# EAGLE design dab_mainboard (EAGLE 7.2.0)
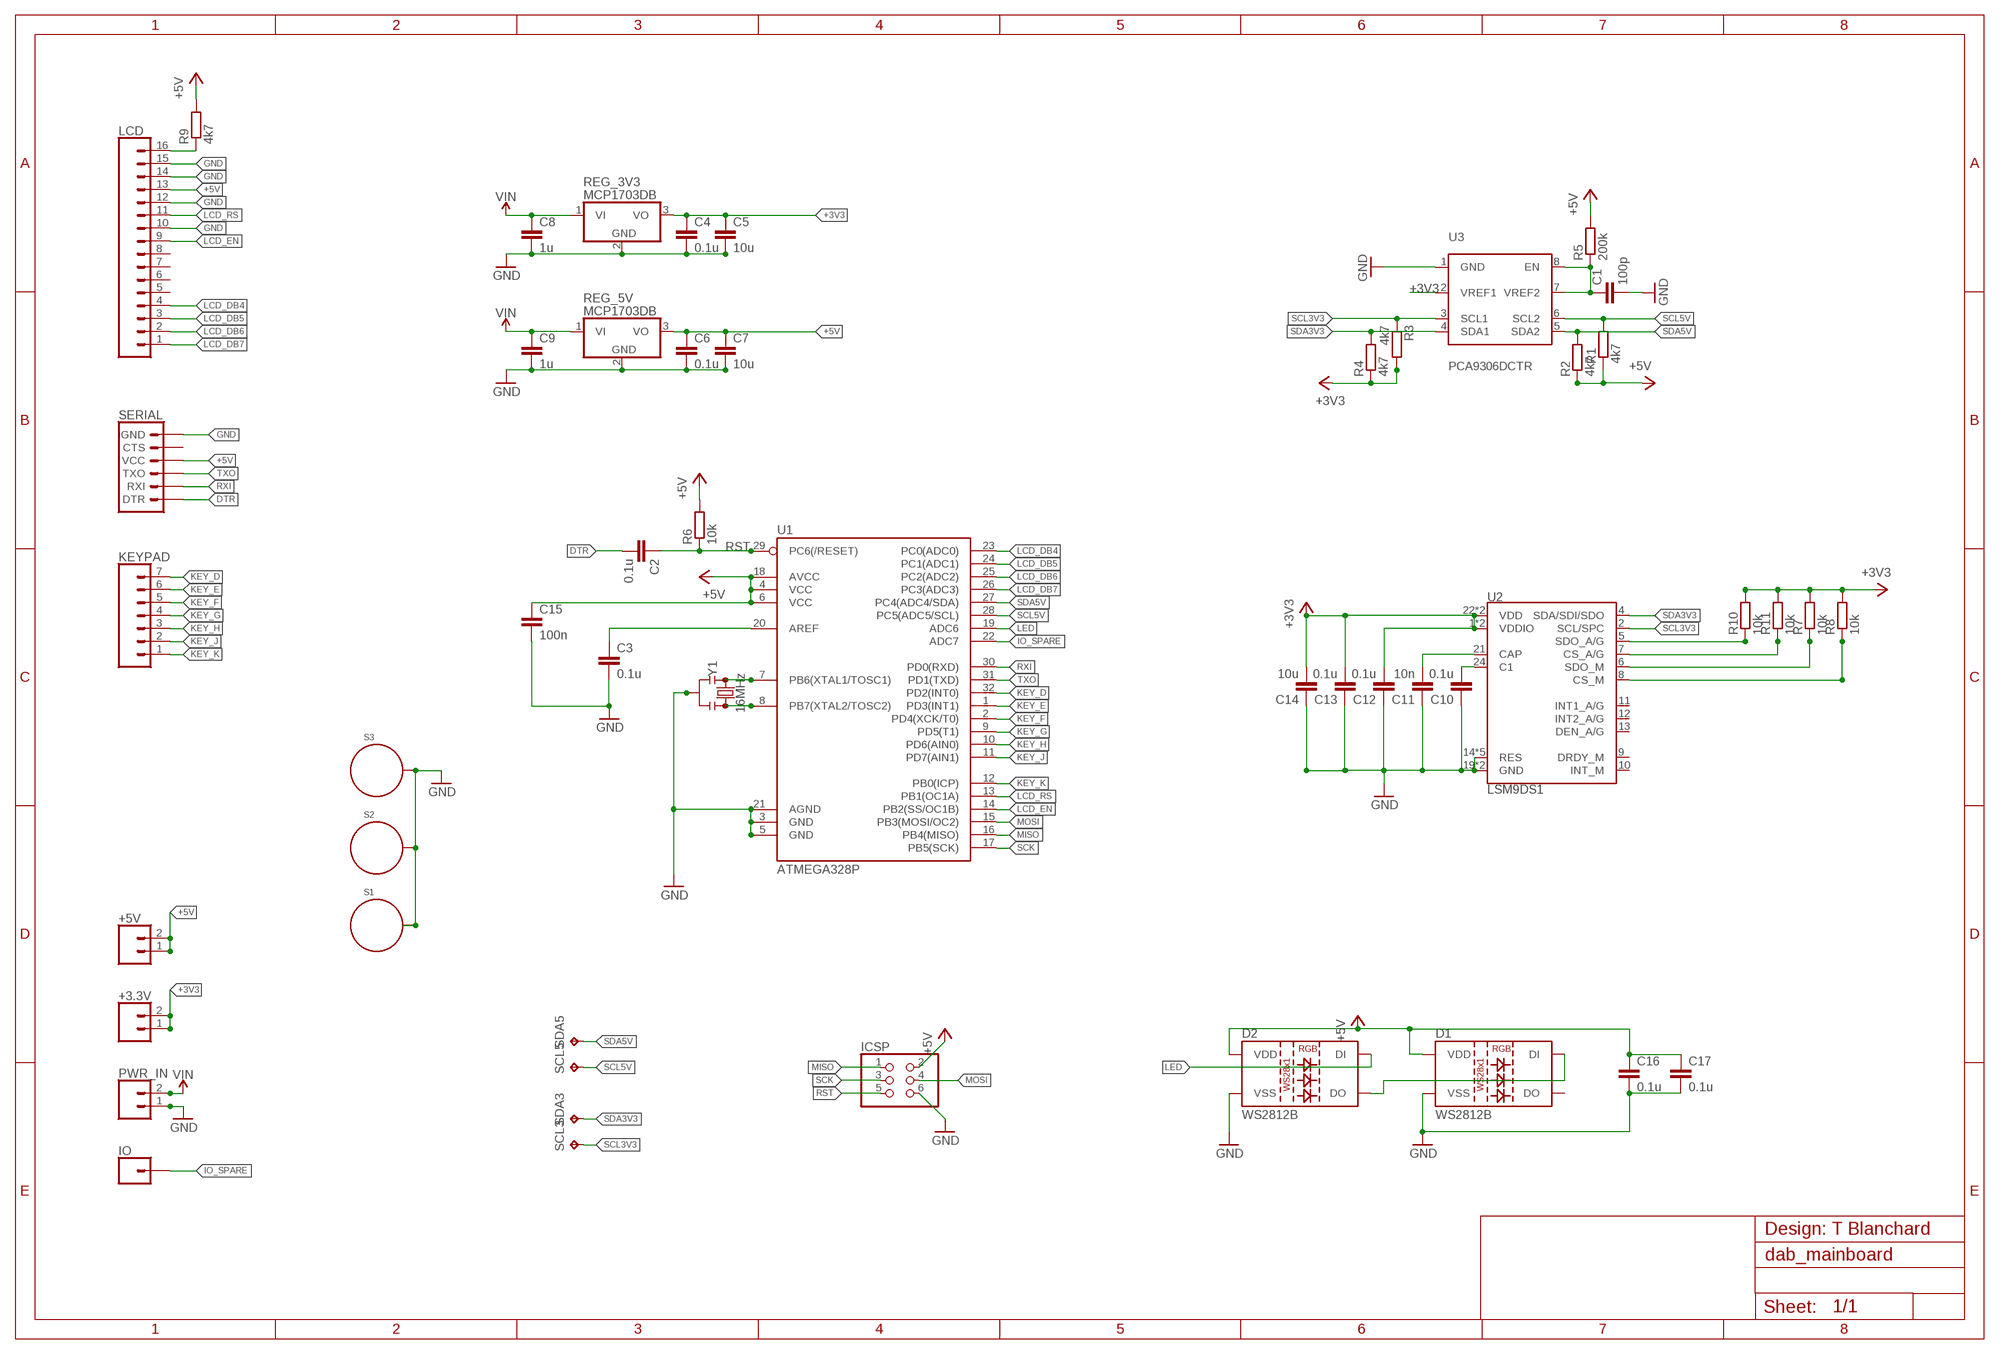
[diagram p0: schematic, sheet 1]

## Parts
+3.3V  CONN_02  [1X02]
+5V  CONN_02  [1X02]
C1  100p  C-EUC0603  [C0603]
C2  0.1u  C-EUC0603  [C0603]
C3  0.1u  C-EUC0603  [C0603]
C4  0.1u  C-EUC0603  [C0603]
C5  10u  C-EUC0805  [C0805]
C6  0.1u  C-EUC0603  [C0603]
C7  10u  C-EUC0805  [C0805]
C8  1u  C-EUC0603  [C0603]
C9  1u  C-EUC0603  [C0603]
C10  0.1u  C-EUC0603  [C0603]
C11  10n  C-EUC0603  [C0603]
C12  0.1u  C-EUC0603  [C0603]
C13  0.1u  C-EUC0603  [C0603]
C14  10u  C-EUC0603  [C0603]
C15  100n  C-EUC0603  [C0603]
C16  0.1u  C-EUC0603  [C0603]
C17  0.1u  C-EUC0603  [C0603]
D1  WS2812B  [WS2812B]
D2  WS2812B  [WS2812B]
ICSP  PINHD-2X3  [2X03]
IO  CONN_01  [1X01]
KEYPAD  CONN_07  [1X07]
LCD  CONN_16  [1X16]
PWR_IN  CONN_02  [1X02]
R1  4k7  R-EU_R0603  [R0603]
R2  4k7  R-EU_R0603  [R0603]
R3  4k7  R-EU_R0603  [R0603]
R4  4k7  R-EU_R0603  [R0603]
R5  200k  R-EU_R0603  [R0603]
R6  10k  R-EU_R0603  [R0603]
R7  10k  R-EU_R0603  [R0603]
R8  10k  R-EU_R0603  [R0603]
R9  4k7  R-EU_R0603  [R0603]
R10  10k  R-EU_R0603  [R0603]
R11  10k  R-EU_R0603  [R0603]
REG_3V3  MCP1703DB  [SOT223]
REG_5V  MCP1703DB  [SOT223]
S1  STANDOFF_ELECTRICAL  [STANDOFF-ELECTRICAL]
S2  STANDOFF_ELECTRICAL  [STANDOFF-ELECTRICAL]
S3  STANDOFF_ELECTRICAL  [STANDOFF-ELECTRICAL]
SCL3  TPTP08R  [TP08R]
SCL5  TPTP08R  [TP08R]
SDA3  TPTP08R  [TP08R]
SDA5  TPTP08R  [TP08R]
SERIAL  6_PIN_SERIAL_TARGETSILK  [6_PIN_SERIAL_TARGET_SIDE_W_SILK]
U1  ATMEGA328P  ATMEGA328P_TQFP  [TQFP32-08]
U2  LSM9DS1  [LGA-24-3.5X3]
U3  PCA9306DCTR  [SM8]
Y1  16MHz  RESONATOR-16MHZSMD_3.2X1.3  [RESONATOR-SMD-3.2X1.3]

## Nets
+3V3: +3.3V.1 +3.3V.2 C4.1 C5.1 C12.2 C13.2 C14.2 R3.2 R4.1 R7.2 R8.2 R10.2 R11.2 REG_3V3.3(VO) U2.1(VDDIO) U2.3(VDDIO) U2.22(VDD) U2.23(VDD) U3.2(VREF1)
+5V: +5V.1 +5V.2 C6.1 C7.1 C15.1 C16.1 C17.1 D1.1(VDD) D2.1(VDD) ICSP.2 LCD.13 R1.1 R2.1 R5.2 R6.2 R9.2 REG_5V.3(VO) SERIAL.P$4(VCC) U1.4(VCC) U1.6(VCC) U1.18(AVCC)
CS_M: R8.1 U2.8(CS_M)
DTR: C2.2 SERIAL.P$1(DTR)
GND: C1.2 C3.2 C4.2 C5.2 C6.2 C7.2 C8.2 C9.2 C10.1 C11.1 C12.1 C13.1 C14.1 C15.2 C16.2 C17.2 D1.3(VSS) D2.3(VSS) ICSP.6 LCD.10 LCD.12 LCD.14 LCD.15 PWR_IN.1 REG_3V3.2(GND) REG_5V.2(GND) S1.P1 S2.P1 S3.P1 SERIAL.P$6(GND) U1.3(GND) U1.5(GND) U1.21(AGND) U2.14(RES) U2.15(RES) U2.16(RES) U2.17(RES) U2.18(RES) U2.19(GND) U2.20(GND) U3.1(GND) Y1.2
IO_SPARE: IO.1 U1.22(ADC7)
KEY_D: KEYPAD.7 U1.32(PD2(INT0))
KEY_E: KEYPAD.6 U1.1(PD3(INT1))
KEY_F: KEYPAD.5 U1.2(PD4(XCK/T0))
KEY_G: KEYPAD.4 U1.9(PD5(T1))
KEY_H: KEYPAD.3 U1.10(PD6(AIN0))
KEY_J: KEYPAD.2 U1.11(PD7(AIN1))
KEY_K: KEYPAD.1 U1.12(PB0(ICP))
LCD_DB4: LCD.4 U1.23(PC0(ADC0))
LCD_DB5: LCD.3 U1.24(PC1(ADC1))
LCD_DB6: LCD.2 U1.25(PC2(ADC2))
LCD_DB7: LCD.1 U1.26(PC3(ADC3))
LCD_EN: LCD.9 U1.14(PB2(SS/OC1B))
LCD_RS: LCD.11 U1.13(PB1(OC1A))
LED: D2.4(DI) U1.19(ADC6)
MISO: ICSP.1 U1.16(PB4(MISO))
MOSI: ICSP.4 U1.15(PB3(MOSI/OC2))
N$1: C1.1 R5.1 U3.7(VREF2) U3.8(EN)
N$2: U1.7(PB6(XTAL1/TOSC1)) Y1.1
N$3: U1.8(PB7(XTAL2/TOSC2)) Y1.3
N$4: R7.1 U2.6(SDO_M)
N$5: C3.1 U1.20(AREF)
N$6: R11.1 U2.7(CS_A/G)
N$7: R10.1 U2.5(SDO_A/G)
N$8: LCD.16 R9.1
N$9: C10.2 U2.24(C1)
N$10: C11.2 U2.21(CAP)
N$11: D1.4(DI) D2.2(DO)
RST: C2.1 ICSP.5 R6.1 U1.29(PC6(/RESET))
RXI: SERIAL.P$3(RXI) U1.30(PD0(RXD))
SCK: ICSP.3 U1.17(PB5(SCK))
SCL3V3: R3.1 SCL3.TP U2.2(SCL/SPC) U3.3(SCL1)
SCL5V: R1.2 SCL5.TP U1.28(PC5(ADC5/SCL)) U3.6(SCL2)
SDA3V3: R4.2 SDA3.TP U2.4(SDA/SDI/SDO) U3.4(SDA1)
SDA5V: R2.2 SDA5.TP U1.27(PC4(ADC4/SDA)) U3.5(SDA2)
TXO: SERIAL.P$2(TXO) U1.31(PD1(TXD))
VIN: C8.1 C9.1 PWR_IN.2 REG_3V3.1(VI) REG_5V.1(VI)
Unconnected: D1.2(DO) LCD.5 LCD.6 LCD.7 LCD.8 SERIAL.P$5(CTS) U2.9(DRDY_M) U2.10(INT_M) U2.11(INT1_A/G) U2.12(INT2_A/G) U2.13(DEN_A/G)

## Notes on the sheet
- Design: T Blanchard

## Library data of the parts
+3.3V +5V PWR_IN = SparkFun-Connectors:CONN_02: Multi connection point. Often used as Generic Header-pin footprint for 0.1 inch spaced/style header connections On any of the 0.1 inch spaced packages, you can populate with these: Break Away Headers - Straight <https://www.sparkfun.com/products/116> (PRT-00116) Break Away Male Headers - Right Angle <https://www.sparkfun.com/products/553> (PRT-00553) Female Headers <https://www.sparkfun.com/products/115> (PRT-00115) Break Away Headers - Machine Pin <https://www.sparkfun.com/products/117> (PRT-00117) Break Away Female Headers - Swiss Machine Pin <https://www.sparkfun.com/products/743> (PRT-00743) For SCREWTERMINALS and SPRING TERMINALS visit here: Screw Terimnals on SparkFun.com <https://www.sparkfun.com/search/results?term=Screw+Terminals> (5mm/3.5mm/2.54mm spacing) This device is also useful as a general connection point to wire up your design to another part of your project. Our various solder wires solder well into these plated through hole pads. Hook-Up Wire - Assortment (Stranded, 22 AWG) <https://www.sparkfun.com/products/11375> (PRT-11375) Hook-Up Wire - Assortment (Solid Core, 22 AWG) <https://www.sparkfun.com/products/11367> (PRT-11367) View the entire wire category on our website here <https://www.sparkfun.com/categories/141> Special notes: Molex polarized connector foot print use with: PRT-08233 with associated crimp pins and housings. 2.54_SCREWTERM for use with PRT-10571. 3.5mm Screw Terminal footprints for PRT-08084 5mm Screw Terminal footprints for use with PRT-08432
C1-C17 = resistor:C-EU: CAPACITOR, European symbol
D1 D2 = SparkFun-LED:WS2812B: WS2812B SMD addressable RGB LED 5x5mm SMD LED with built-in controller IC. Color: Red/Green/Blue mC Rating: RGB: 390, 660, 180 mcd Forward Voltage: RGB: 2.0, 3.0, 3.0 V Packages:WS2812B SparkFun Products: Blynk Board - ESP8266 <https://www.sparkfun.com/products/13794>; PROD_ID: DIO-12503
ICSP = pinhead:PINHD-2X3: PIN HEADER
IO = SparkFun-Connectors:CONN_01: Single connection point. Often used as Generic Header-pin footprint for 0.1 inch spaced/style header connections On any of the 0.1 inch spaced packages, you can populate with these: Break Away Headers - Straight <https://www.sparkfun.com/products/116> (PRT-00116) Break Away Male Headers - Right Angle <https://www.sparkfun.com/products/553> (PRT-00553) Female Headers <https://www.sparkfun.com/products/115> (PRT-00115) Break Away Headers - Machine Pin <https://www.sparkfun.com/products/117> (PRT-00117) Break Away Female Headers - Swiss Machine Pin <https://www.sparkfun.com/products/743> (PRT-00743) This device is also useful as a general connection point to wire up your design to another part of your project. Our various solder wires solder well into these plated through hole pads. Hook-Up Wire - Assortment (Stranded, 22 AWG) <https://www.sparkfun.com/products/11375> (PRT-11375) Hook-Up Wire - Assortment (Solid Core, 22 AWG) <https://www.sparkfun.com/products/11367> (PRT-11367) View the entire wire category on our website here <https://www.sparkfun.com/categories/141> Special notes: SMTSO-256-ET is a "flush mount" nut for a 4-40 screw. We mostly use this on specialty testbeds; it is a nice way to connect hardware to your PCB at an adjustable hieght. Also note, the SNAP packages are for using a snappable style connector. We sell a baggie of snaps and they are also used on two LilyPad designs: Snap Assortment - 30 pack (male and female) <https://www.sparkfun.com/products/11347> (DEV-11347) LilyPad Arduino SimpleSnap <https://www.sparkfun.com/products/10941> (DEV-10941) LilyPad SimpleSnap Protoboard <https://www.sparkfun.com/products/10940> (DEV-10940)
KEYPAD = SparkFun-Connectors:CONN_07: Multi connection point. Often used as Generic Header-pin footprint for 0.1 inch spaced/style header connections On any of the 0.1 inch spaced packages, you can populate with these: Break Away Headers - Straight <https://www.sparkfun.com/products/116> (PRT-00116) Break Away Male Headers - Right Angle <https://www.sparkfun.com/products/553> (PRT-00553) Female Headers <https://www.sparkfun.com/products/115> (PRT-00115) Break Away Headers - Machine Pin <https://www.sparkfun.com/products/117> (PRT-00117) Break Away Female Headers - Swiss Machine Pin <https://www.sparkfun.com/products/743> (PRT-00743) For SCREWTERMINALS and SPRING TERMINALS visit here: Screw Terimnals on SparkFun.com <https://www.sparkfun.com/search/results?term=Screw+Terminals> (5mm/3.5mm/2.54mm spacing) This device is also useful as a general connection point to wire up your design to another part of your project. Our various solder wires solder well into these plated through hole pads. Hook-Up Wire - Assortment (Stranded, 22 AWG) <https://www.sparkfun.com/products/11375> (PRT-11375) Hook-Up Wire - Assortment (Solid Core, 22 AWG) <https://www.sparkfun.com/products/11367> (PRT-11367) View the entire wire category on our website here <https://www.sparkfun.com/categories/141> Special notes: Molex polarized connector foot print use with SKU : PRT-08231 with associated crimp pins and housings. 1MM SMD Version SKU: PRT-10208 NOTES ON THE VARIANTS LOCK and LOCK_LONGPADS... This footprint was designed to help hold the alignment of a through-hole component (i.e. 6-pin header) while soldering it into place. You may notice that each hole has been shifted either up or down by 0.005 of an inch from it's more standard position (which is a perfectly straight line). This slight alteration caused the pins (the squares in the middle) to touch the edges of the holes. Because they are alternating, it causes a "brace" to hold the component in place. 0.005 has proven to be the perfect amount of "off-center" position when using our standard breakaway headers. Although looks a little odd when you look at the bare footprint, once you have a header in there, the alteration is very hard to notice. Also,if you push a header all the way into place, it is covered up entirely on the bottom side.
LCD = SparkFun-Connectors:CONN_16: Multi connection point. Often used as Generic Header-pin footprint for 0.1 inch spaced/style header connections On any of the 0.1 inch spaced packages, you can populate with these: Break Away Headers - Straight <https://www.sparkfun.com/products/116> (PRT-00116) Break Away Male Headers - Right Angle <https://www.sparkfun.com/products/553> (PRT-00553) Female Headers <https://www.sparkfun.com/products/115> (PRT-00115) Break Away Headers - Machine Pin <https://www.sparkfun.com/products/117> (PRT-00117) Break Away Female Headers - Swiss Machine Pin <https://www.sparkfun.com/products/743> (PRT-00743) For SCREWTERMINALS and SPRING TERMINALS visit here: Screw Terimnals on SparkFun.com <https://www.sparkfun.com/search/results?term=Screw+Terminals> (5mm/3.5mm/2.54mm spacing) This device is also useful as a general connection point to wire up your design to another part of your project. Our various solder wires solder well into these plated through hole pads. Hook-Up Wire - Assortment (Stranded, 22 AWG) <https://www.sparkfun.com/products/11375> (PRT-11375) Hook-Up Wire - Assortment (Solid Core, 22 AWG) <https://www.sparkfun.com/products/11367> (PRT-11367) View the entire wire category on our website here <https://www.sparkfun.com/categories/141> Special notes: Molex polarized connector foot print use with SKU : PRT-08231 with associated crimp pins and housings. 1MM SMD Version SKU: PRT-10208 NOTES ON THE VARIANTS LOCK and LOCK_LONGPADS... This footprint was designed to help hold the alignment of a through-hole component (i.e. 6-pin header) while soldering it into place. You may notice that each hole has been shifted either up or down by 0.005 of an inch from it's more standard position (which is a perfectly straight line). This slight alteration caused the pins (the squares in the middle) to touch the edges of the holes. Because they are alternating, it causes a "brace" to hold the component in place. 0.005 has proven to be the perfect amount of "off-center" position when using our standard breakaway headers. Although looks a little odd when you look at the bare footprint, once you have a header in there, the alteration is very hard to notice. Also,if you push a header all the way into place, it is covered up entirely on the bottom side.
R1-R11 = rcl:R-EU_: RESISTOR, European symbol
REG_3V3 REG_5V = linear:MCP1703: 250 mA, 16V, Low Quiescent Current LDO Regulator Source: http://ww1.microchip.com/downloads/en/DeviceDoc/22049b.pdf
S1-S3 = SparkFun-Electromechanical:STANDOFF_ELECTRICAL: A standoff intended to be an electrically connected point. Pad size and stop size allow for a #4 Phillips pan screw head to make a solid connection to the board.
SCL3 SCL5 SDA3 SDA5 = testpad:TP: Test pad
SERIAL = SparkFun-Connectors:6_PIN_SERIAL_TARGET: 6-pin header connection for use with the "FTDI BASIC" pinout - TARGET SIDE. Also known as "Arduino Serial Program Header". It is used to mate with our FTDI Basic serial programmers using the Arduino IDE. Note, this device has "TARGET" in the name. It is intended to be used on a design that contains a target micro-controller that you wish to program. The "sister" device, named "CABLE" is inteneded to be used on a design that usually lives on the end of your USB cable and prvides the converter chip (FTDI232 or FTDI231x) to commnicate serial RX/TX. You can populate with some of these: Break Away Headers - Straight <https://www.sparkfun.com/products/116> (PRT-00116) For reference (or to suit your programming needs) check out these designs: SparkFun FTDI Basic Breakout - 5V <https://www.sparkfun.com/products/9716> (DEV-09716) SparkFun FTDI Basic Breakout - 3.3V <https://www.sparkfun.com/products/9873> (DEV-09873) SparkFun FTDI SmartBasic <https://www.sparkfun.com/products/12935> (DEV-12935) SparkFun Beefy 3 - FTDI Basic Breakout <https://www.sparkfun.com/products/13746> (DEV-13746)
U1 = SparkFun-IC-Microcontroller:ATMEGA328P_TQFP: Popular 328P in QFP Storefront component: ATmega328 - TQFP <https://www.sparkfun.com/products/13448> (COM-13448) Datasheet <http://www.sparkfun.com/datasheets/Components/SMD/ATMega328.pdf> SparkFun Products SparkFun RedBoard - Programmed with Arduino <https://www.sparkfun.com/products/12757> (DEV-12757) Arduino Pro Mini 328 - 5V/16MHz <https://www.sparkfun.com/products/11113> (DEV-11113) Arduino Pro Mini 328 - 3.3V/8MHz <https://www.sparkfun.com/products/11114> (DEV-11114) SparkFun OpenLog <https://www.sparkfun.com/products/13712> (DEV-13712) SparkFun MicroView - OLED Arduino Module <https://www.sparkfun.com/products/12923> (DEV-12923) SparkFun Digital Sandbox <https://www.sparkfun.com/products/12651> (DEV-12651) SparkFun PicoBoard <https://www.sparkfun.com/products/11888> (WIG-11888) Arduino Fio <https://www.sparkfun.com/products/10116> (DEV-10116) LilyPad Arduino 328 Main Board <https://www.sparkfun.com/products/13342> (DEV-13342) SparkFun RedStick <https://www.sparkfun.com/products/13741> (DEV-13741) LilyPad MP3 <https://www.sparkfun.com/products/11013> (DEV-11013) LilyPad Arduino SimpleSnap <https://www.sparkfun.com/products/10941> (DEV-10941) SparkFun Stepoko <https://www.sparkfun.com/products/13899> (ROB-13899) SparkFun Geiger Counter <https://www.sparkfun.com/products/11345> (SEN-11345) SparkFun EL Sequencer <https://www.sparkfun.com/products/12781> (COM-12781) Arduino Pro 328 - 5V/16MHz <https://www.sparkfun.com/products/10915> (DEV-10915) CryptoCape <https://www.sparkfun.com/products/12773> (DEV-12773) SparkFun IR Thermometer Evaluation Board - MLX90614 <https://www.sparkfun.com/products/10740> (SEN-10740) SparkFun RedBot Mainboard <https://www.sparkfun.com/products/12097> (ROB-12097) Arduino Pro 328 - 3.3V/8MHz <https://www.sparkfun.com/products/10914> (DEV-10914) SparkFun Block for Intel® Edison - Arduino <https://www.sparkfun.com/products/13036> (DEV-13036) SparkFun Simon Says - Surface Mount Soldering Kit <https://www.sparkfun.com/products/10935> (KIT-10935) SparkFun 7-Segment Serial Display - Red <https://www.sparkfun.com/products/11441> (COM-11441) SparkFun 7-Segment Serial Display - White <https://www.sparkfun.com/products/11629> (COM-11629) SparkFun 7-Segment Serial Display - Yellow <https://www.sparkfun.com/products/11443> (COM-11443) SparkFun 7-Segment Serial Display - Kelly Green <https://www.sparkfun.com/products/11440> (COM-11440) SparkFun 7-Segment Serial Display - Blue <https://www.sparkfun.com/products/11442> (COM-11442) SparkFun OpenSegment Serial Display - 20mm (Blue) <https://www.sparkfun.com/products/11647> (COM-11647) SparkFun OpenSegment Serial Display - 20mm (Green) <https://www.sparkfun.com/products/11646> (COM-11646) SparkFun OpenSegment Serial Display - 20mm (White) <https://www.sparkfun.com/products/11648> (COM-11648) SparkFun OpenSegment Serial Display - 20mm (Red) <https://www.sparkfun.com/products/11644> (COM-11644) SparkFun OpenSegment Serial Display - 20mm (Yellow) <https://www.sparkfun.com/products/11645> (COM-11645) SparkFun OpenSegment Shield <https://www.sparkfun.com/products/13190> (DEV-13190); PROD_ID: IC-09069; VALUE: ATMEGA328P_TQFP
U2 = SparkFun-Sensors:LSM9DS1: ST Microelectronics LSM9DS1 9DOF IMU - Accelerometer, Gyroscope & Magnetometer The LSM9DS1 is a versatile, motion-sensing system-in-a-chip. It houses a 3-axis accelerometer, 3-axis gyroscope, and 3-axis magnetometer – nine degrees of freedom (9DOF) in a single IC! The LSM9DS1 is equipped with a digital interface, but even that is flexible: it supports both I2C and SPI, so you’ll be hard-pressed to find a microcontroller it doesn’t work with. Datasheet <https://cdn.sparkfun.com/assets/learn_tutorials/3/7/3/LSM9DS1_Datasheet.pdf> SparkFun Products SparkFun 9 Degrees of Freedom IMU Breakout - LSM9DS1 <https://www.sparkfun.com/products/13284> (SEN-13284) SparkFun Photon IMU Shield <https://www.sparkfun.com/products/13629> (DEV-13629); PROD_ID: IC-12536
U3 = my_libs:PCA9306DCTR
Y1 = SparkFun-Clocks:RESONATOR-16MHZ: 16MHz Resonator Digikey Example <http://www.digikey.com/product-detail/en/murata-electronics-north-america/CSTCE16M0V53-R0/490-1198-1-ND/584635> Frequency: 16MHz Frequency Stability: ±0.3% Frequency Tolerance: ±0.5% Capacitance: 15pF SparkFun Products SparkFun OpenLog <https://www.sparkfun.com/products/13712> SparkFun MicroView - OLED Arduino Module <https://www.sparkfun.com/products/12923>; PROD_ID: XTAL-08900

## Board
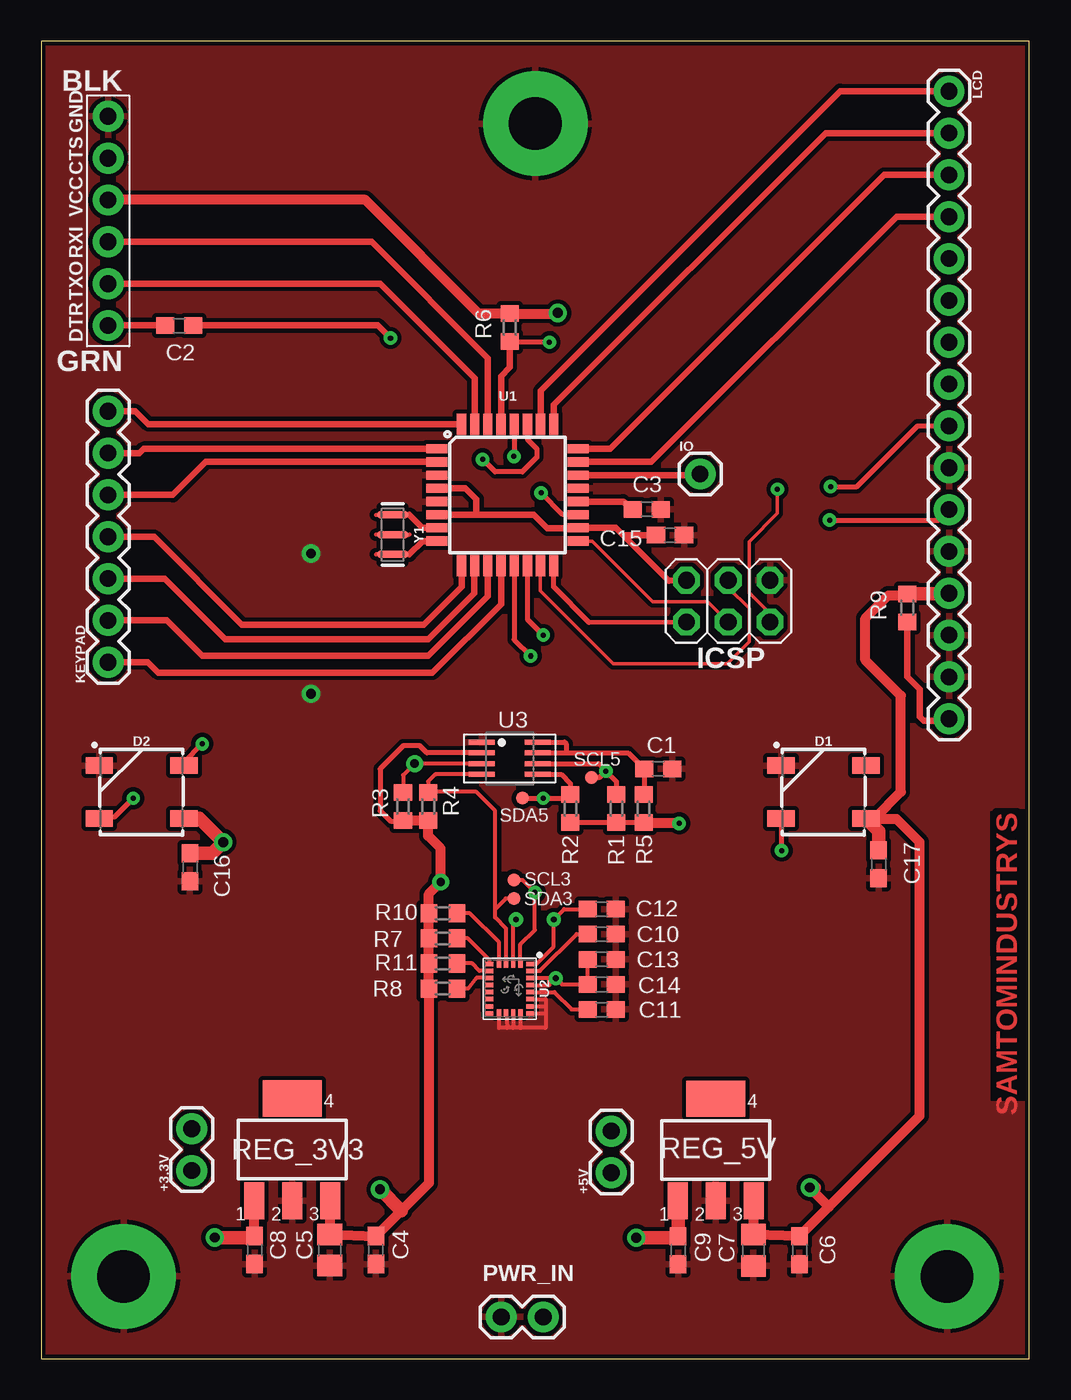
[diagram p1: board, top side]
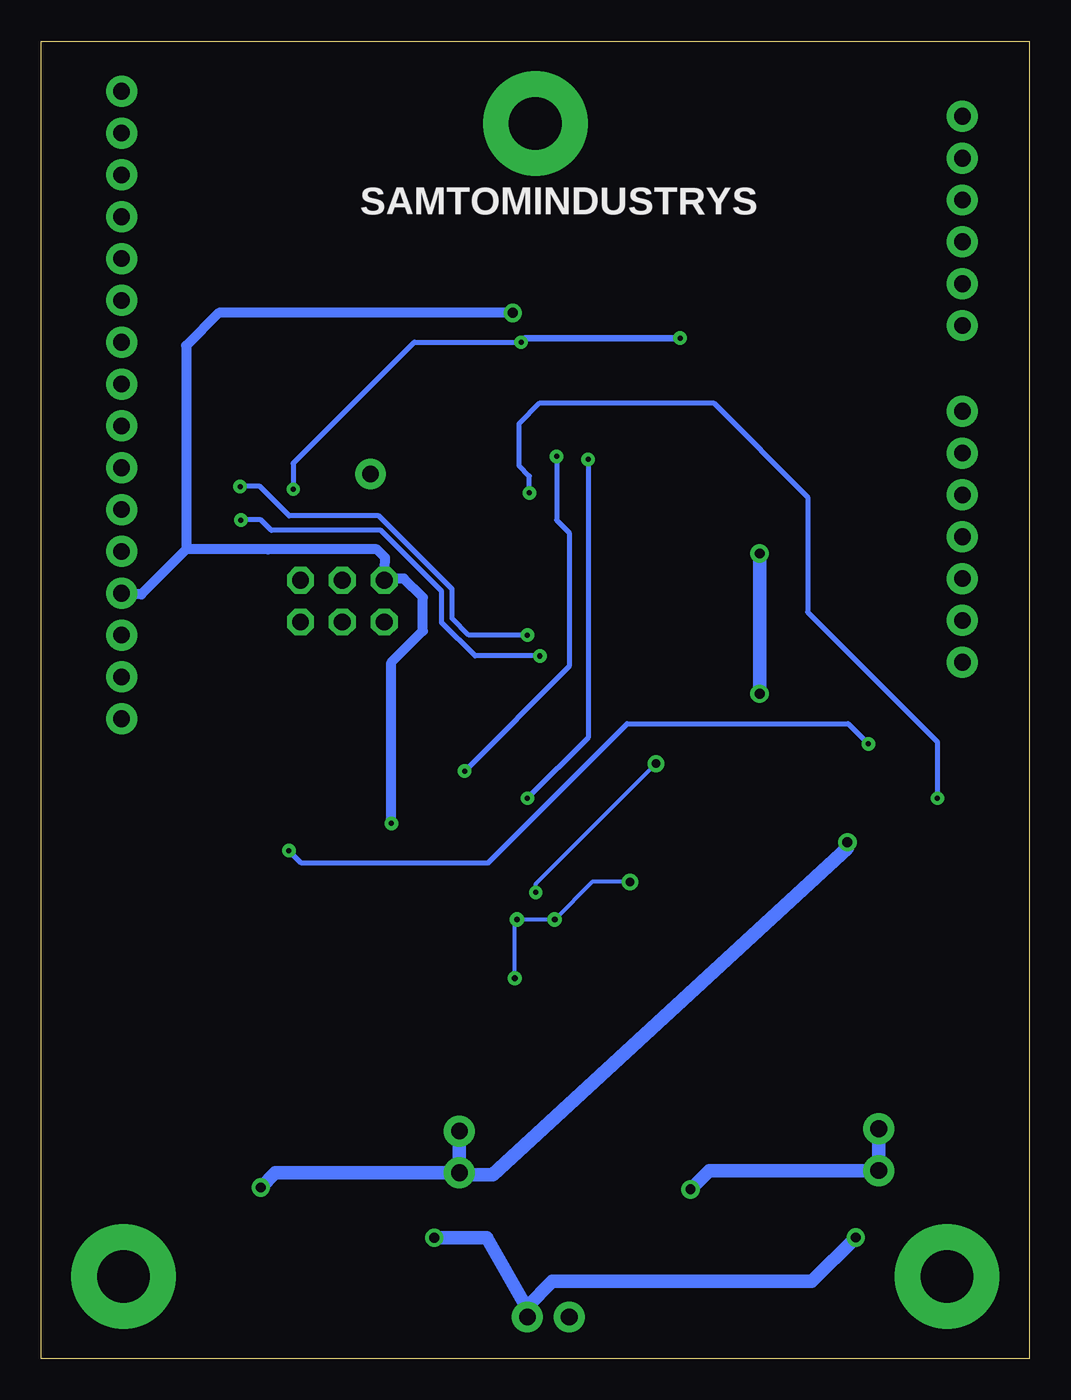
[diagram p2: board, bottom side, seen from below]

Size 60 x 80 mm. Coordinates in mm from the lower left corner, seen from the top.
Outline: 0,0 60,0 60,80 0,80 0,0
Copper layers (1*16): Top 0.035mm / dielectric 1.5mm / Bottom 0.035mm
Design rules "SparkFun": minimum track width 8mil, minimum drill 20mil, track to track 8mil, track to pad 8mil, pad to pad 8mil, via to via 8mil, smd to smd 8mil, copper to edge 10mil, drill to drill 8mil, minimum pad ring 12mil, minimum via ring 10mil, stop-mask expansion 4mil, vias tented up to drill 25mil, thermal gap 10mil

### Footprints (pad centres in the part's own frame; a part is rotated, then mirrored left to right if it is on the bottom)
1X02 = drill 1.016 pad 1.88: 1 0,0; 2 2.54,0
C0603 = smd 1.1 x 1: 1 -0.85,0; 2 0.85,0
C0805 = smd 1.3 x 1.5: 1 -0.95,0; 2 0.95,0
WS2812B = smd 1.651 x 1: 1 2.577,-1.6; 2 2.577,1.6; 3 -2.577,1.6; 4 -2.577,-1.6
2X03 = drill 1.016 octagon: 1 -2.54,-1.27; 2 -2.54,1.27; 3 0,-1.27; 4 0,1.27; 5 2.54,-1.27; 6 2.54,1.27
1X01 = drill 1.016 pad 1.88: 1 0,0
1X07 = drill 1.016 pad 1.88: 1 0,0; 2 2.54,0; 3 5.08,0; 4 7.62,0; 5 10.16,0; 6 12.7,0; 7 15.24,0
1X16 = drill 1.016 pad 1.88: 1 0,0; 2 2.54,0; 3 5.08,0; 4 7.62,0; 5 10.16,0; 6 12.7,0; 7 15.24,0; 8 17.78,0; 9 20.32,0; 10 22.86,0; 11 25.4,0; 12 27.94,0; 13 30.48,0; 14 33.02,0; 15 35.56,0; 16 38.1,0
R0603 = smd 1 x 1.1: 1 -0.85,0; 2 0.85,0
SOT223 = smd 1.219 x 2.235: 1 -2.311,-3.099; 2 0,-3.099; 3 2.311,-3.099 | smd 3.6 x 2.2: 4 0,3.099
STANDOFF-ELECTRICAL = drill 3.2 pad 6.35: P1 0,0
TP08R = smd 0.8 x 0.8: TP 0,0
6_PIN_SERIAL_TARGET_SIDE_W_SILK = drill 1.016 pad 1.88: P$1 -6.35,0; P$2 -3.81,0; P$3 -1.27,0; P$4 1.27,0; P$5 3.81,0; P$6 6.35,0
TQFP32-08 = smd 1.27 x 0.559: 1 -4.293,2.8; 2 -4.293,2; 3 -4.293,1.2; 4 -4.293,0.4; 5 -4.293,-0.4; 6 -4.293,-1.2; 7 -4.293,-2; 8 -4.293,-2.8; 17 4.293,-2.8; 18 4.293,-2; 19 4.293,-1.2; 20 4.293,-0.4; 21 4.293,0.4; 22 4.293,1.2; 23 4.293,2; 24 4.293,2.8 | smd 0.559 x 1.27: 9 -2.8,-4.293; 10 -2,-4.293; 11 -1.2,-4.293; 12 -0.4,-4.293; 13 0.4,-4.293; 14 1.2,-4.293; 15 2,-4.293; 16 2.8,-4.293; 25 2.8,4.293; 26 2,4.293; 27 1.2,4.293; 28 0.4,4.293; 29 -0.4,4.293; 30 -1.2,4.293; 31 -2,4.293; 32 -2.8,4.293
LGA-24-3.5X3 = smd 0.27 x 0.45: 1 -1.505,1.225; 6 -1.505,-1.225; 7 -1.075,-1.225; 8 -0.645,-1.225; 9 -0.215,-1.225; 10 0.215,-1.225; 11 0.645,-1.225; 12 1.075,-1.225; 13 1.505,-1.225; 18 1.505,1.225; 19 1.075,1.225; 20 0.645,1.225; 21 0.215,1.225; 22 -0.215,1.225; 23 -0.645,1.225; 24 -1.075,1.225 | smd 0.45 x 0.27: 2 -1.475,0.645; 3 -1.475,0.215; 4 -1.475,-0.215; 5 -1.475,-0.645; 14 1.475,-0.645; 15 1.475,-0.215; 16 1.475,0.215; 17 1.475,0.645
SM8 = smd 0.3 x 1.6: 1 -0.988,-1.7; 2 -0.338,-1.7; 3 0.312,-1.7; 4 0.963,-1.7; 5 0.963,1.7; 6 0.312,1.7; 7 -0.338,1.7; 8 -0.988,1.7
RESONATOR-SMD-3.2X1.3 = smd 0.45 x 1.905: 1 -1.2,0; 2 0,0; 3 1.2,0

### Placement (x,y rotation side)
+3.3V  9.14,11.43 90 top
+5V  34.61,11.29 90 top
C1  37.47,35.81 0 top
C2  8.38,62.74 180 top
C3  36.78,51.57 0 top
C4  20.32,6.6 270 top
C5  17.53,6.6 270 top
C6  46.04,6.59 270 top
C7  43.24,6.59 270 top
C8  12.95,6.6 270 top
C9  38.67,6.59 270 top
C10  34.04,25.78 180 top
C11  34.04,21.21 180 top
C12  34.04,27.3 180 top
C13  34.04,24.26 180 top
C14  34.04,22.73 180 top
C15  38.18,50 0 top
C16  9.03,29.85 270 top
C17  50.85,30.03 270 top
D1  47.5,34.42 0 top
D2  6.1,34.42 0 top
ICSP  41.72,46 0 top
IO  40.01,53.72 0 top
KEYPAD  4.06,42.29 90 top
LCD  55.12,76.96 270 top
PWR_IN  27.94,2.54 0 top
R1  34.92,33.4 90 top
R2  32.13,33.4 90 top
R3  21.97,33.53 270 top
R4  23.5,33.53 90 top
R5  36.58,33.4 270 top
R6  28.45,62.61 90 top
R7  24.38,25.53 180 top
R8  24.38,22.48 180 top
R9  52.58,45.59 90 top
R10  24.38,27.05 180 top
R11  24.38,24 180 top
REG_3V3  15.24,12.7 0 top
REG_5V  40.96,12.69 0 top
S1  55,5 0 top
S2  5,5 0 top
S3  30,75 0 top
SCL3  28.7,29.08 0 top
SCL5  33.4,35.31 0 top
SDA3  28.7,27.94 0 top
SDA5  29.21,34.04 0 top
SERIAL  4.06,69.09 90 top
U1  28.32,52.45 0 top
U2  28.45,22.48 270 top
U3  28.45,36.45 270 top
Y1  21.34,50.04 270 top

### Tracks (layer width: path | path; a pad name or v marks a point on that pad's centre or on a via)
+3V3  (via drill 0.36 pad 0.76, 0.51, 0.6)
  Top 0.254: U2.1 30.08,23.98 31.11,25.02 v31.11,26.67 31.75,27.3 C12.2 | C13.2 C14.2 31.62,22.73 v31.24,23.11 31.23,23.12 30.86,23.12 | U2.22 30.86,22.69 30.86,23.12 | U2.23 30.86,23.12 | U2.3 28.66,26.5 v28.83,26.67
  Top 0.305: U3.2 23.41,36.79 22.99,37.21 21.97,37.21 20.57,35.81 20.57,33.27 21.21,32.64 21.93,32.64 R3.2
  Top 0.61: REG_3V3.3 17.53,9.6 C5.1 C4.1 21.86,9 23.53,10.67 R8.2 R11.2 R7.2 R10.2 23.53,28.23 v24.26,28.96 24.26,30.99 23.5,31.75 R4.1 R3.2
  Top 0.813: v20.57,10.29 21.86,9
  Bottom 0.254: v31.24,23.11 31.24,26.54 v31.11,26.67 v28.83,26.67 26.54,28.96 v24.26,28.96
  Bottom 0.813: +3.3V.2 +3.3V.1 19.43,11.43 v20.57,10.29
+5V  (via drill 0.3 pad 0.71, 0.6)
  Top 0.305: R5.2 R1.1 R2.1
  Top 0.406: U1.6 26.42,51.25 | 26.42,51.25 29.9,51.25 30.73,50.42 32.58,50.42 U1.18 34.89,50.45 35.34,50.01 | U1.4 25.76,52.85 26.42,52.2 26.42,51.25 | 35.34,50.01 38.1,47.24 ICSP.2 | 31.33,63.46 v31.37,63.5 | C15.1 35.34,50.01
  Top 0.61: REG_5V.3 43.24,9.59 C7.1 C6.1 47.83,9.23 | SERIAL.P$4 19.68,70.36 26.58,63.46 R6.2 31.33,63.46 | R5.2 38.7,32.55 v38.73,32.51 | R9.2 52.49,46.35 51.44,46.35 50.04,44.96 50.04,42.42 52.2,40.26 52.2,34.42 50.6,32.82 D1.1 50.13,32.77 51.94,32.77 53.34,31.37 53.34,14.74 47.83,9.23 | v46.67,10.4 47.83,9.24 47.83,9.23
  Top 0.813: v46.67,10.4 46.93,10.4 | D2.1 9.6,32.82 v11.05,31.37 10.38,30.7 C16.1 | R9.2 55.08,46.44 LCD.13 | C17.1 50.85,32.05 D1.1
  Bottom 0.406: 46.1,49.28 46.23,49.15
  Bottom 0.61: 51.18,49.15 46.23,49.15 39.62,49.15 39.12,48.64 ICSP.2 38.99,47.37 37.97,47.37 36.83,46.23 36.83,44.2 38.73,42.29 v38.73,32.51 | 51.18,49.15 53.91,46.42 55.05,46.42 LCD.13 | v31.37,63.5 49.21,63.5 51.19,61.52 51.19,49.15 51.18,49.15
  Bottom 0.813: +5V.2 +5V.1 | +5V.1 45.78,11.29 v46.67,10.4 | v11.05,31.37 11.05,30.99 32.58,11.16 34.48,11.16 +5V.1
CS_M
  Top 0.254: U2.8 26.43,23.12 25.91,22.48 R8.1
DTR
  Top 0.406: C2.2 SERIAL.P$1
GND  (via drill 0.6)
  Top 0.254: U2.20 30.63,21.83 30.63,21.4 | 30.63,21.4 30.63,20.97 | 30.63,20.97 30.63,20.09 29.1,20.09 | 29.1,20.09 28.65,20.09 | 28.65,20.09 28.28,20.09 | 28.28,20.09 27.8,20.09 U2.14 | U2.19 30.63,21.4 | U2.18 30.63,20.97 | U2.17 29.1,20.09 | U2.16 28.65,20.09 | U2.15 28.28,20.09
  Bottom 0.813: v16.38,40.39 v16.38,48.9
  pour Top (isolate 0.254): 0,0 60,0 60,80 0,79.76
IO_SPARE
  Top 0.406: U1.22 39.94,53.65 IO.1
KEY_D
  Top 0.406: U1.32 6.5,56.74 5.71,57.53 KEYPAD.7
KEY_E
  Top 0.406: U1.1 6.23,55.25 5.97,54.99 KEYPAD.6
KEY_F
  Top 0.406: U1.2 10,54.45 8,52.45 KEYPAD.5
KEY_G
  Top 0.406: KEYPAD.4 6.86,49.91 12.19,44.58 23.24,44.58 25.53,46.86 U1.9
KEY_H
  Top 0.406: U1.10 26.32,48.35 26.29,48.39 26.29,46.48 23.5,43.69 11.18,43.69 7.49,47.37 KEYPAD.3
KEY_J
  Top 0.406: U1.11 27.12,46.3 23.5,42.67 9.78,42.67 7.62,44.83 KEYPAD.2
KEY_K
  Top 0.406: U1.12 27.92,45.83 23.75,41.66 7.11,41.66 6.48,42.29 KEYPAD.1
LCD_DB4
  Top 0.406: U1.23 37.05,54.45 51.94,69.34 LCD.4
LCD_DB5
  Top 0.406: U1.24 34.55,55.25 51.18,71.88 LCD.3
LCD_DB6
  Top 0.406: U1.25 31.12,57.92 47.62,74.42 LCD.2
LCD_DB7
  Top 0.406: U1.26 30.32,58.77 48.51,76.96 LCD.1
LCD_EN  (via drill 0.3 pad 0.71)
  Top 0.305: U1.14 29.52,44.9 v30.48,43.94 | v47.92,52.96 49.53,52.96 53.21,56.64 LCD.9
  Bottom 0.305: v30.48,43.94 34.04,43.94 35.05,44.96 35.05,46.74 39.5,51.18 44.94,51.18 46.72,52.96 v47.92,52.96
LCD_RS  (via drill 0.3 pad 0.71)
  Top 0.305: U1.13 28.72,43.67 v29.72,42.67 | v47.87,50.93 54.48,50.93 LCD.11
  Bottom 0.305: v29.72,42.67 33.66,42.67 35.69,44.7 35.69,46.61 39.37,50.29 46.02,50.29 46.66,50.93 v47.87,50.93
LED  (via drill 0.3 pad 0.71)
  Top 0.305: U1.19 31.68,51.25 v30.35,52.58 | v5.59,34.04 4.45,32.89 3.6,32.89 D2.4
  Bottom 0.305: v30.35,52.58 30.35,53.59 30.99,54.23 30.99,56.77 29.72,58.04 19.18,58.04 13.46,52.32 13.46,45.34 5.59,37.47 v5.59,34.04
MISO
  Top 0.305: ICSP.1 33.27,44.7 31.11,46.86 U1.16
MOSI
  Top 0.203: U1.15 30.3,48.14 30.3,46.63 34.72,42.22 41.66,42.22 42.98,43.54 42.98,45.57 41.72,46.83 ICSP.4
N$1
  Top 0.305: U3.7 31.88,36.79 | 31.88,36.79 35.64,36.79 C1.1 36.62,34.29 R5.1 | U3.8 31.78,37.44 31.88,37.34 31.88,36.79
N$2
  Top 0.406: U1.7 23.14,50.45 22.35,51.24
N$3
  Top 0.406: U1.8 23.16,49.65 22.35,48.84
N$4
  Top 0.254: U2.6 27.22,24.21 25.91,25.53 R7.1
N$5
  Top 0.406: U1.20 35.33,52.05 C3.1
N$6
  Top 0.254: U2.7 26.61,23.55 26.16,24 R11.1
N$7
  Top 0.254: U2.5 27.8,25.28 26.04,27.05 R10.1
N$8
  Top 0.406: R9.1 52.58,41.4 53.34,40.64 53.34,38.99 53.59,38.73 54.99,38.73 LCD.16
N$9
  Top 0.254: U2.24 30.29,23.55 32.51,25.78 C10.2
N$10
  Top 0.254: U2.21 31.15,22.26 32.21,21.21 C11.2
N$11  (via drill 0.3 pad 0.71)
  Top 0.305: D2.2 8.67,36.23 v9.78,37.34 | v44.96,30.86 44.96,32.78 D1.4
  Bottom 0.305: 9.91,37.34 v9.78,37.34 11.01,38.57 24.42,38.57 32.89,30.1 44.2,30.1 v44.96,30.86
N$12
  cutout Top: 27.2,37.9 29.9,37.9 29.9,35 27.2,35
N$13
  cutout Top: 59.87,33.15 57.68,33.17 57.71,15.72 59.84,15.7
RST  (via drill 0.3 pad 0.71)
  Top 0.203: v44.7,52.8 v44.7,52.79 44.7,51.33 42.98,49.61 42.98,46.51 44.26,45.23 ICSP.5
  Top 0.305: v30.86,61.72 28.49,61.72 R6.1
  Top 0.406: U1.29 27.92,59.67 28.45,60.2 R6.1 | C2.1 20.45,62.74 v21.21,61.98
  Bottom 0.305: v30.86,61.72 37.34,61.72 44.7,54.36 v44.7,52.8
  Bottom 0.406: v21.21,61.98 30.61,61.98 v30.86,61.72
RXI
  Top 0.406: U1.30 27.12,60.76 20.07,67.82 SERIAL.P$3
SCK
  Top 0.203: U1.17 33.46,49.65 37.13,45.97 40.48,45.97 ICSP.3
SCL3V3  (via drill 0.3 pad 0.71, 0.51)
  Top 0.254: U2.2 29.09,25.16 29.97,26.04 v29.97,28.32 29.21,29.08 SCL3.TP | U3.3 v22.67,36.14 21.97,35.43 R3.1
  Bottom 0.254: v29.97,28.32 29.97,28.84 v22.67,36.14
SCL5V  (via drill 0.3 pad 0.71)
  Top 0.305: U3.6 33.84,36.14 v34.29,35.69 | R1.2 34.92,35.05 v34.29,35.69 | U1.28 28.72,55.14 v28.7,54.79 | SCL5.TP 33.91,35.31 v34.29,35.69
  Bottom 0.305: v34.29,35.69 27.94,42.04 27.94,50.16 28.7,50.93 v28.7,54.79
SDA3V3
  Top 0.254: U2.4 28.23,26.12 27.56,26.8 27.56,27.3 | U3.4 23.93,35.49 23.5,35.05 R4.2 23.53,34.42 26.42,34.42 27.56,33.27 27.56,27.3 | SDA3.TP 28.19,27.94 27.56,27.3
SDA5V  (via drill 0.3 pad 0.71)
  Top 0.305: U3.5 31.57,35.49 32.13,34.92 R2.2 31.92,34.04 v30.48,34.04 SDA5.TP | U1.27 29.52,55.82 30.1,55.24 30.1,54.74 29.21,53.85 27.56,53.85 v26.8,54.61
  Bottom 0.305: v26.8,54.61 26.8,37.72 v30.48,34.04
TXO
  Top 0.406: U1.31 26.32,59.53 20.57,65.28 SERIAL.P$2
VIN  (via drill 0.6)
  Top 0.61: C8.1 12.93,7.45 REG_3V3.1
  Top 0.813: v36.13,7.35 38.58,7.35 C9.1 38.67,9.56 REG_5V.1 | v10.54,7.37 12.87,7.37 C8.1
  Bottom 0.813: v36.13,7.35 32.96,7.35 30.48,3.05 PWR_IN.2 30.48,3.17 28.96,4.7 13.21,4.7 v10.54,7.37

### Text on the board
Top: SAMTOMINDUSTRYS
bNames: SAMTOMINDUSTRYS